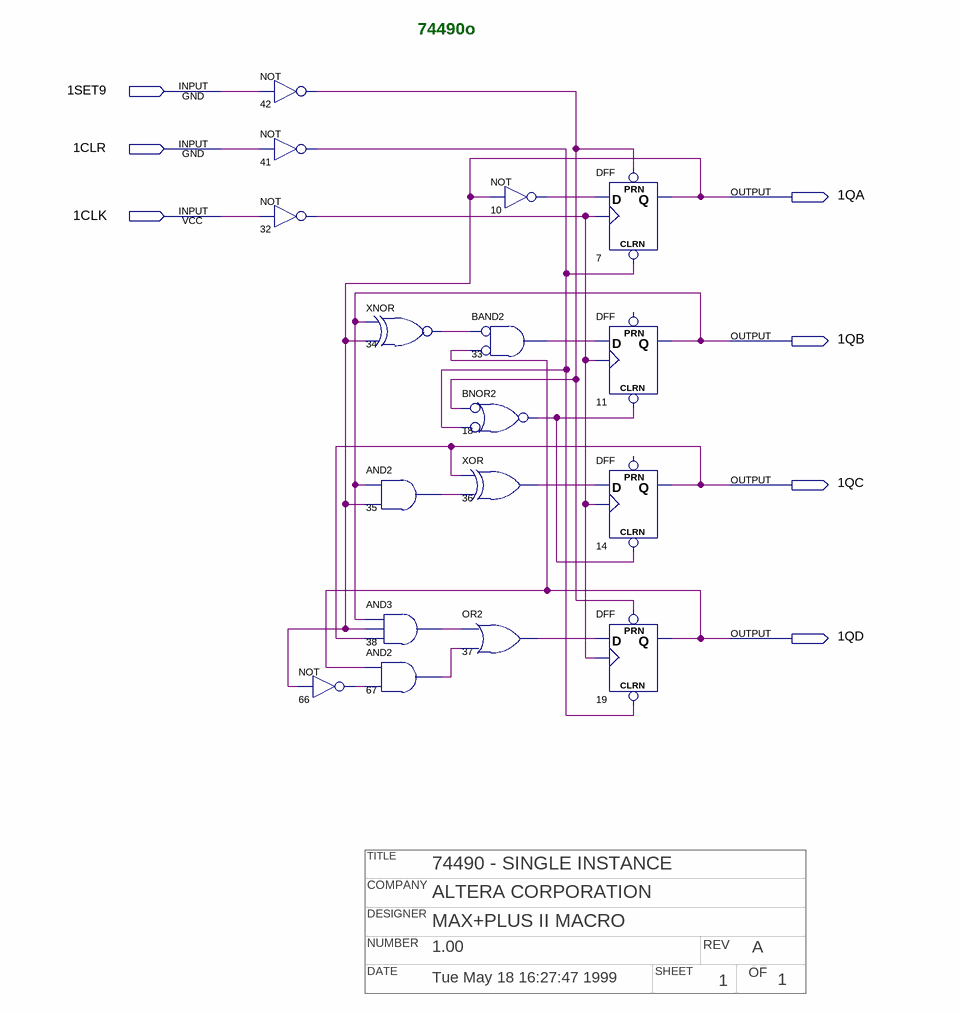
[diagram p0: schematic sheet]
// Quartus schematic 74490o.bdf as structural Verilog: 17 symbols, 7 pins
// Title block: TITLE: 74490 - SINGLE INSTANCE; COMPANY: ALTERA CORPORATION; DESIGNER: MAX+PLUS II MACRO; NUMBER: 1.00; REV: A; DATE: Tue May 18 16:27:47 1999; SHEET: 1; OF: 1
module \74490o  (
  input  \1SET9 ,
  input  \1CLR ,
  input  \1CLK ,
  output \1QA ,
  output \1QB ,
  output \1QC ,
  output \1QD 
);

  wire n10_out, n18_out, n32_out, n33_out, n34_out, n35_out, n36_out, n37_out, n38_out, n41_out, n42_out,
       n66_out, n67_out;

  not u_42 (n42_out, \1SET9 );
  not u_41 (n41_out, \1CLR );
  not u_32 (n32_out, \1CLK );
  not u_66 (n66_out, \1QA );
  xnor u_34 (n34_out, \1QB , \1QA );
  and u_35 (n35_out, \1QB , \1QA );
  and u_38 (n38_out, \1QB , \1QA , \1QC );
  and u_67 (n67_out, \1QD , n66_out);
  not u_10 (n10_out, \1QA );
  and u_33 (n33_out, ~n34_out, ~\1QD );  // BAND2
  nor u_18 (n18_out, ~n42_out, ~n41_out);  // BNOR2
  xor u_36 (n36_out, \1QC , n35_out);
  or u_37 (n37_out, n38_out, n67_out);
  DFF u_7 (.CLRN(n41_out), .CLK(n32_out), .D(n10_out), .PRN(n42_out), .Q(\1QA ));
  DFF u_11 (.CLRN(n18_out), .CLK(n32_out), .D(n33_out), .Q(\1QB ));  // open: PRN
  DFF u_14 (.CLRN(n18_out), .CLK(n32_out), .D(n36_out), .Q(\1QC ));  // open: PRN
  DFF u_19 (.CLRN(n41_out), .CLK(n32_out), .D(n37_out), .PRN(n42_out), .Q(\1QD ));

  // Notes on the sheet:
  //   74490o
endmodule
